# Altium schematic sheet TRIANGLEPOWERSUPPLY.SchDoc
size A
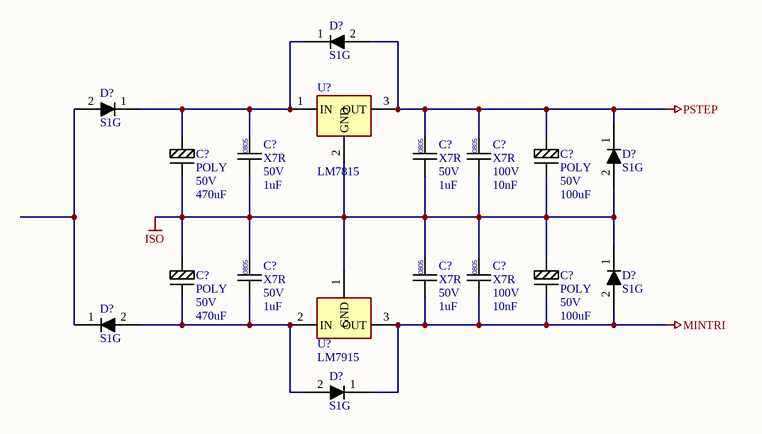
[diagram p0: TRIANGLEPOWERSUPPLY.SchDoc]

## Parts
(Parts that share a designator on the sheet are numbered #1, #2 ... from top to bottom, then left to right.)
C?#1  Dielectric: POLY  Voltage: 50V  Capacitance: 470uF  [CAPC0603]  (hidden comment: CAPP)
C?#2  Dielectric: X7R  Voltage: 50V  Capacitance: 1uF  [CAPC0805]  (hidden comment: CAP0805)
C?#3  Dielectric: X7R  Voltage: 50V  Capacitance: 1uF  [CAPC0805]  (hidden comment: CAP0805)
C?#4  Dielectric: X7R  Voltage: 100V  Capacitance: 10nF  [CAPC0805]  (hidden comment: CAP0805)
C?#5  Dielectric: POLY  Voltage: 50V  Capacitance: 100uF  [CAPC0603]  (hidden comment: CAPP)
C?#6  Dielectric: POLY  Voltage: 50V  Capacitance: 470uF  [CAPC0603]  (hidden comment: CAPP)
C?#7  Dielectric: X7R  Voltage: 50V  Capacitance: 1uF  [CAPC0805]  (hidden comment: CAP0805)
C?#8  Dielectric: X7R  Voltage: 50V  Capacitance: 1uF  [CAPC0805]  (hidden comment: CAP0805)
C?#9  Dielectric: X7R  Voltage: 100V  Capacitance: 10nF  [CAPC0805]  (hidden comment: CAP0805)
C?#10  Dielectric: POLY  Voltage: 50V  Capacitance: 100uF  [CAPC0603]  (hidden comment: CAPP)
D?#1  S1G
D?#2  S1G
D?#3  S1G
D?#4  S1G
D?#5  S1G
D?#6  S1G
U?#1  LM7815  [SOT23]
U?#2  LM7915  [SOT23]

## Nets
ISO: C?#1.2 C?#2.2 C?#3.2 C?#4.2 C?#5.2 C?#6.1 C?#7.1 C?#8.1 C?#9.1 C?#10.1 D?#3.2(A) D?#4.1(K) U?#1.2(GND) U?#2.1(GND)
MINTRI: C?#8.2 C?#9.2 C?#10.2 D?#4.2(A) D?#6.1(K) U?#2.3(OUT)
PSTEP: C?#3.1 C?#4.1 C?#5.1 D?#1.2(A) D?#3.1(K) U?#1.3(OUT)
NetC?#1_1: C?#1.1 C?#2.1 D?#1.1(K) D?#2.1(K) U?#1.1(IN)
NetC?#6_2: C?#6.2 C?#7.2 D?#5.2(A) D?#6.2(A) U?#2.2(IN)
NetD?#2_2: D?#2.2(A) D?#5.1(K)

## Notes on the sheet
- (in symbol CAPC-0805-1uF-50V) 0805
- (in symbol CAPC-0805-10nF-100V) 0805

## Library data of the parts
C?#1 C?#6 = CAPP-0603-470uF-50V-POLY: CAPACITOR,POLYMER,470uF,50V,100X102; Manufacturer 1: PANASONIC; Manufacturer Part Number 1: EEHZC1H101P; Package / Case: CAPP100D102H; Location: *; LCSC: C161937
C?#2 C?#3 C?#7 C?#8 = CAPC-0805-1uF-50V: CAPACITOR,CERAMIC,1uF,50V,X7R,0805; Package / Case: 0805 (2012 metric); Location: *
C?#4 C?#9 = CAPC-0805-10nF-100V: CAPACITOR,CERAMIC,10nF,100V,X7R,0805; Package / Case: 0805 (2012 metric); Location: *
C?#5 C?#10 = CAPP-0603-100uF-50V-POLY: CAPACITOR,POLYMER,100uF,50V,100X102; Manufacturer 1: PANASONIC; Manufacturer Part Number 1: EEHZC1H101P; Package / Case: CAPP100D102H; Location: *; LCSC: C161937
D?#1-D?#6 = DIODE-SMC-S1G: Manufacturer 1: SMC DIODE SOLUTIONS; Manufacturer Part Number 1: S1G
U?#1 = IC-TI-LM7815: IC,VOLTAGE REG,LIN,POSITIVE,15V,7815,TO220; LCSC: C460608
U?#2 = IC-TI-LM7915: IC,VOLTAGE REG,LIN,NEGATIVE,7915,TO220; LCSC: C460608